# Altium project MCORD_MCX_SAS.PrjPcb
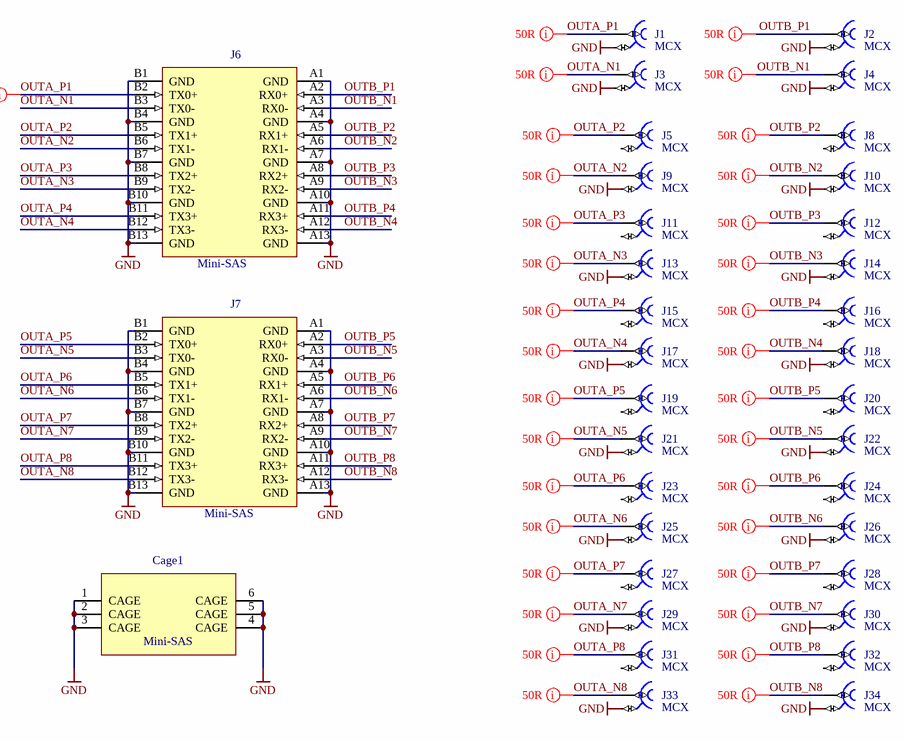
[diagram p0: MCORD_MCX_SAS.SchDoc]
1 sheet, 35 parts. Net scope: hierarchical (ports join the sheet entries above them; power ports are global).
Board file: MCORD_MCX_SAS.PcbDoc

## Sheet MCORD_MCX_SAS.SchDoc: MCORD_HUB
size 420 x 297 mm; Author: G.Kasprowicz; CompanyName: WUT ISE; DrawnBy: G.Kasprowicz; Organization: WUT ISE; Address1: PW ISE; Address2: Nowowiejska 15/19 00-665 Warsaw; Address3: gkasprow@gmail.com; DocumentNumber: 1; Revision: 2; SheetNumber: 1; SheetTotal: 6; ModifiedBy: -; CheckedDate: -; Title2: Top; DivGrp: WUT ISE; Designer: G.Kasprowicz; ModifiedDate: -; ProjectName: Sensor Box

### Parts
Cage1  Mini-SAS  [TYCO_1888321-2]
J1  MCX  [AMPHENOL_919-383J-51A]
J2  MCX  [AMPHENOL_919-383J-51A]
J3  MCX  [AMPHENOL_919-383J-51A]
J4  MCX  [AMPHENOL_919-383J-51A]
J5  MCX  [AMPHENOL_919-383J-51A]
J6  Mini-SAS  [TYCO_1761987-7]
J7  Mini-SAS  [TYCO_1761987-7]
J8  MCX  [AMPHENOL_919-383J-51A]
J9  MCX  [AMPHENOL_919-383J-51A]
J10  MCX  [AMPHENOL_919-383J-51A]
J11  MCX  [AMPHENOL_919-383J-51A]
J12  MCX  [AMPHENOL_919-383J-51A]
J13  MCX  [AMPHENOL_919-383J-51A]
J14  MCX  [AMPHENOL_919-383J-51A]
J15  MCX  [AMPHENOL_919-383J-51A]
J16  MCX  [AMPHENOL_919-383J-51A]
J17  MCX  [AMPHENOL_919-383J-51A]
J18  MCX  [AMPHENOL_919-383J-51A]
J19  MCX  [AMPHENOL_919-383J-51A]
J20  MCX  [AMPHENOL_919-383J-51A]
J21  MCX  [AMPHENOL_919-383J-51A]
J22  MCX  [AMPHENOL_919-383J-51A]
J23  MCX  [AMPHENOL_919-383J-51A]
J24  MCX  [AMPHENOL_919-383J-51A]
J25  MCX  [AMPHENOL_919-383J-51A]
J26  MCX  [AMPHENOL_919-383J-51A]
J27  MCX  [AMPHENOL_919-383J-51A]
J28  MCX  [AMPHENOL_919-383J-51A]
J29  MCX  [AMPHENOL_919-383J-51A]
J30  MCX  [AMPHENOL_919-383J-51A]
J31  MCX  [AMPHENOL_919-383J-51A]
J32  MCX  [AMPHENOL_919-383J-51A]
J33  MCX  [AMPHENOL_919-383J-51A]
J34  MCX  [AMPHENOL_919-383J-51A]

### Nets
GND: Cage1.1(CAGE) Cage1.2(CAGE) Cage1.3(CAGE) Cage1.4(CAGE) Cage1.5(CAGE) Cage1.6(CAGE) J1.2 J2.2 J3.2 J4.2 J6.A1(GND) J6.A4(GND) J6.A7(GND) J6.A10(GND) J6.A13(GND) J6.B1(GND) J6.B4(GND) J6.B7(GND) J6.B10(GND) J6.B13(GND) J7.A1(GND) J7.A4(GND) J7.A7(GND) J7.A10(GND) J7.A13(GND) J7.B1(GND) J7.B4(GND) J7.B7(GND) J7.B10(GND) J7.B13(GND) J9.2 J10.2 J13.2 J14.2 J17.2 J18.2 J21.2 J22.2 J25.2 J26.2 J29.2 J30.2 J33.2 J34.2
OUTA_N1: J3.1 J6.B3(TX0-)
OUTA_N2: J6.B6(TX1-) J9.1
OUTA_N3: J6.B9(TX2-) J13.1
OUTA_N4: J6.B12(TX3-) J17.1
OUTA_N5: J7.B3(TX0-) J21.1
OUTA_N6: J7.B6(TX1-) J25.1
OUTA_N7: J7.B9(TX2-) J29.1
OUTA_N8: J7.B12(TX3-) J33.1
OUTA_P1: J1.1 J6.B2(TX0+)
OUTA_P2: J5.1 J6.B5(TX1+)
OUTA_P3: J6.B8(TX2+) J11.1
OUTA_P4: J6.B11(TX3+) J15.1
OUTA_P5: J7.B2(TX0+) J19.1
OUTA_P6: J7.B5(TX1+) J23.1
OUTA_P7: J7.B8(TX2+) J27.1
OUTA_P8: J7.B11(TX3+) J31.1
OUTB_N1: J4.1 J6.A3(RX0-)
OUTB_N2: J6.A6(RX1-) J10.1
OUTB_N3: J6.A9(RX2-) J14.1
OUTB_N4: J6.A12(RX3-) J18.1
OUTB_N5: J7.A3(RX0-) J22.1
OUTB_N6: J7.A6(RX1-) J26.1
OUTB_N7: J7.A9(RX2-) J30.1
OUTB_N8: J7.A12(RX3-) J34.1
OUTB_P1: J2.1 J6.A2(RX0+)
OUTB_P2: J6.A5(RX1+) J8.1
OUTB_P3: J6.A8(RX2+) J12.1
OUTB_P4: J6.A11(RX3+) J16.1
OUTB_P5: J7.A2(RX0+) J20.1
OUTB_P6: J7.A5(RX1+) J24.1
OUTB_P7: J7.A8(RX2+) J28.1
OUTB_P8: J7.A11(RX3+) J32.1

Not connected (* = marked no-connect by the designer): J5 2; J8 2; J11 2; J12 2; J15 2; J16 2; J19 2; J20 2; J23 2; J24 2; J27 2; J28 2; J31 2; J32 2

### Layout directives
net class 50R: OUTA_N1, OUTA_N2, OUTA_N3, OUTA_N4, OUTA_N5, OUTA_N6, OUTA_N7, OUTA_N8, OUTA_P1, OUTA_P2, OUTA_P3, OUTA_P4, OUTA_P5, OUTA_P6, OUTA_P7, OUTA_P8, OUTB_N1, OUTB_N2, OUTB_N3, OUTB_N4, OUTB_N5, OUTB_N6, OUTB_N7, OUTB_N8, OUTB_P1, OUTB_P2, OUTB_P3, OUTB_P4, OUTB_P5, OUTB_P6, OUTB_P7, OUTB_P8

### Notes on the sheet
- Project/Equipment
- Document
- Designer
- Drawn by
- Check.by
- Copyright WUT ISE 2018.
  This documentation describes Open Hardware and is licensed under the CERN OHL v.1.1. You may redistribute and modify this documentation under the terms of the CERN OHL v.1.1. (http://ohwr.org/CERNOHL). This documentation is distributed WITHOUT ANY EXPRESS OR IMPLIED WARRANTY, INCLUDING OF MERCHANTABILITY, SATISFACTORY QUALITY AND FITNESS FOR A PARTICULAR PURPOSE. Please see the CERN OHL v.1.1 for applicable conditions.
- Contact
- File
- Last Mod.
- Print Date
- Sheet
- Size
- A3
- of
- Rev

### Library data of the parts
Cage1 = TYCO_1888321-2: Mini-SAS Cage (6Pins); Part Description: Through Hole Dual Port EVERCLEAR Mini-SAS Cage; Manufacturer: TYCO ELECTRONICS; PressFit: No; Part Number: TYCO_1888321-2; Component Kind: Standard; Component Type: Standard; Pin Count: 10; Family: Mini-SAS; Mounted: Yes; Socket: No; SMD: No; Sense: No; Status: None; Manufacturer Part Number: 1888321-2; ComponentHeight: 8.63mm; HelpURL: \\cern.ch\dfs\Applications\Altium\Datasheets\TYCO_1888321-2.pdf; Author: CERN DEM BC; CreateDate: 04.04.2019; LatestRevisionDate: 04.04.2019
J1-J5 J8-J34 = AMPHENOL_919-383J-51A: Part Description: 50 Ohm, RF Connector, MCX Right Angle PCB Receptacle Jack; PressFit: No; Part Number: AMPHENOL_919-383J-51A; Component Kind: Standard; Component Type: Standard; Pin Count: 5; Family: MCX; Mounted: Yes; Socket: No; SMD: No; Sense: No; Status: None; Manufacturer: AMPHENOL; Manufacturer Part Number: 919-383J-51A; ComponentHeight: 6mm; HelpURL: \\cern.ch\dfs\Applications\Altium\Datasheets\AMPHENOL_919-383J-51A.pdf; Author: CERN DEM BC; CreateDate: 31.01.2019; LatestRevisionDate: 31.01.2019
J6 J7 = TYCO_1761987-7: 26 Position Mini-Sas Connector (Quad Small Form-Factor SFF-8088); Part Description: Surface Mount EVERCLEAR Mini-SAS Right Angle Receptacle (Quad Small Form-Factor SFF-8088); Manufacturer: TYCO ELECTRONICS; PressFit: No; Part Number: TYCO_1761987-7; Component Kind: Standard; Component Type: Standard; Pin Count: 26; Family: Mini-SAS; Mounted: Yes; Socket: No; SMD: Yes; Sense: No; Status: None; Manufacturer Part Number: 1761987-7; ComponentHeight: 5.55mm; HelpURL: \\cern.ch\dfs\Applications\Altium\Datasheets\TYCO_1761987-7.pdf; Author: CERN DEM MR; CreateDate: 24.04.2019; LatestRevisionDate: 24.04.2019